# Altium schematic sheet STM32G031C8T6.schdoc
size 127 x 101 mm
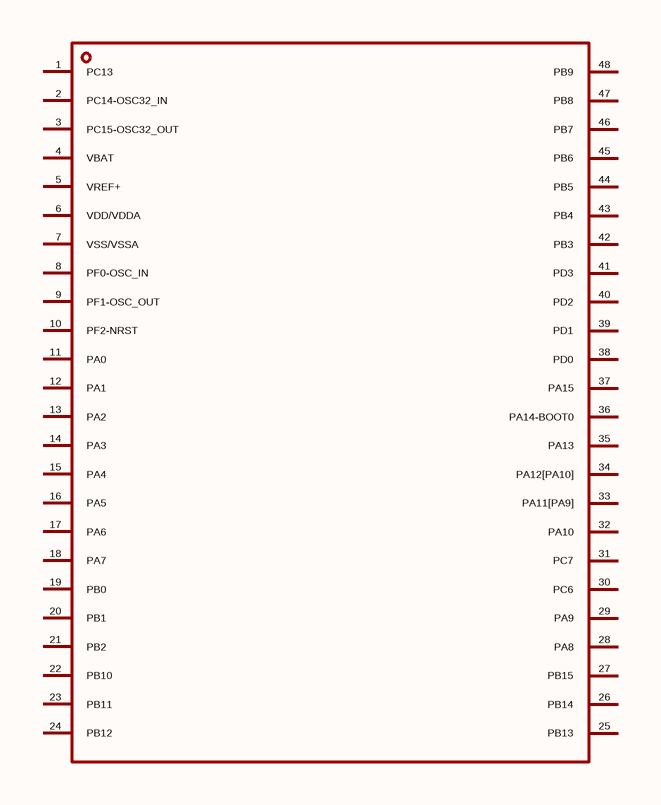
[diagram p0: STM32G031C8T6.schdoc]

## Parts
U?  stm32g031c8t6  [LQFP-48_L7.0-W7.0-P0.50-LS9.0-BL]  (value not drawn)

## Nets

Not connected (* = marked no-connect by the designer): U? 1(PC13) 2(PC14-OSC32_IN) 3(PC15-OSC32_OUT) 4(VBAT) 5(VREF+) 6(VDD/VDDA) 7(VSS/VSSA) 8(PF0-OSC_IN) 9(PF1-OSC_OUT) 10(PF2-NRST) 11(PA0) 12(PA1) 13(PA2) 14(PA3) 15(PA4) 16(PA5) 17(PA6) 18(PA7) 19(PB0) 20(PB1) 21(PB2) 22(PB10) 23(PB11) 24(PB12) 25(PB13) 26(PB14) 27(PB15) 28(PA8) 29(PA9) 30(PC6) 31(PC7) 32(PA10) 33(PA11[PA9]) 34(PA12[PA10]) 35(PA13) 36(PA14-BOOT0) 37(PA15) 38(PD0) 39(PD1) 40(PD2) 41(PD3) 42(PB3) 43(PB4) 44(PB5) 45(PB6) 46(PB7) 47(PB8) 48(PB9)

## Library data of the parts
U? = stm32g031c8t6: CPU内核:ARM Cortex-M0+;CPU最大主频:64MHz;CPU位数:32 Bit;; Manufacturer: ST(意法半导体); AddInBom: yes; ModelId: 093be70396ff421eb2cdb946d5311efc; ModelName: LQFP-48_L7.0-W7.0-H1.4-LS9.0-P0.50; ModelTransform: 354.331,354.331,0,0,0,0,0,0,0; CPU Maximum Speed: 64MHz; Core Size: 32 Bit; Program Storage Size: 64KB; Program Memory Type: FLASH; RAM Size: 8KB; Number of I/O: 44; ADC (Bit): 12bit; Oscillator Type: 内置+外置; Voltage - Supply: 1.7V~3.6V; Symbol: STM32G031C8T6; LCSC Part Name: 主流Arm Cortex-M0+ MCU，具有64 KB Flash存储器、8 KB RAM、64 MHz CPU、2x USART、定时器、ADC和通信接口，1.7-3.6V; SupplierPart: C432205; ManufacturerPart: STM32G031C8T6; Supplier Footprint: LQFP-48(7x7); JLCPCB Part Class: Extended Part; Datasheet: https://item.szlcsc.com/datasheet/STM32G031C8T6/428993.html; Supplier: LCSC; ConvertToPcb: yes; FootprintName: LQFP-48_L7.0-W7.0-P0.50-LS9.0-BL; CPU Core: ARM Cortex-M0+; EEPROM: -; Operating Temperature: -40℃~+85℃